# Altium schematic sheet llrf_afe_pwr.SchDoc: =GlobalProjectName
size 209 x 297 mm; SheetNumber: 9; SheetTotal: 17; PageSetup: Record=PageOptions|CenterHorizontal=True|CenterVertical=True|PrintScale=1.00|XCorrection=1.00|YCorrection=1.00|PrintKind=1|BorderSize=5000000|LeftOffset=0|BottomOffset=0|Orientation=2|PaperLength=1000|PaperWidth=1000|Scale=100|PaperSource=15|PrintQuality=1200|MediaType=1|DitherType=10|PaperKind=A3|PrintScaleMode=1; Weight: -; ScaleFactor: -; R_EN1: 100к; R_EN2: NU; R_FB1: 150к; R_FB2: 47к
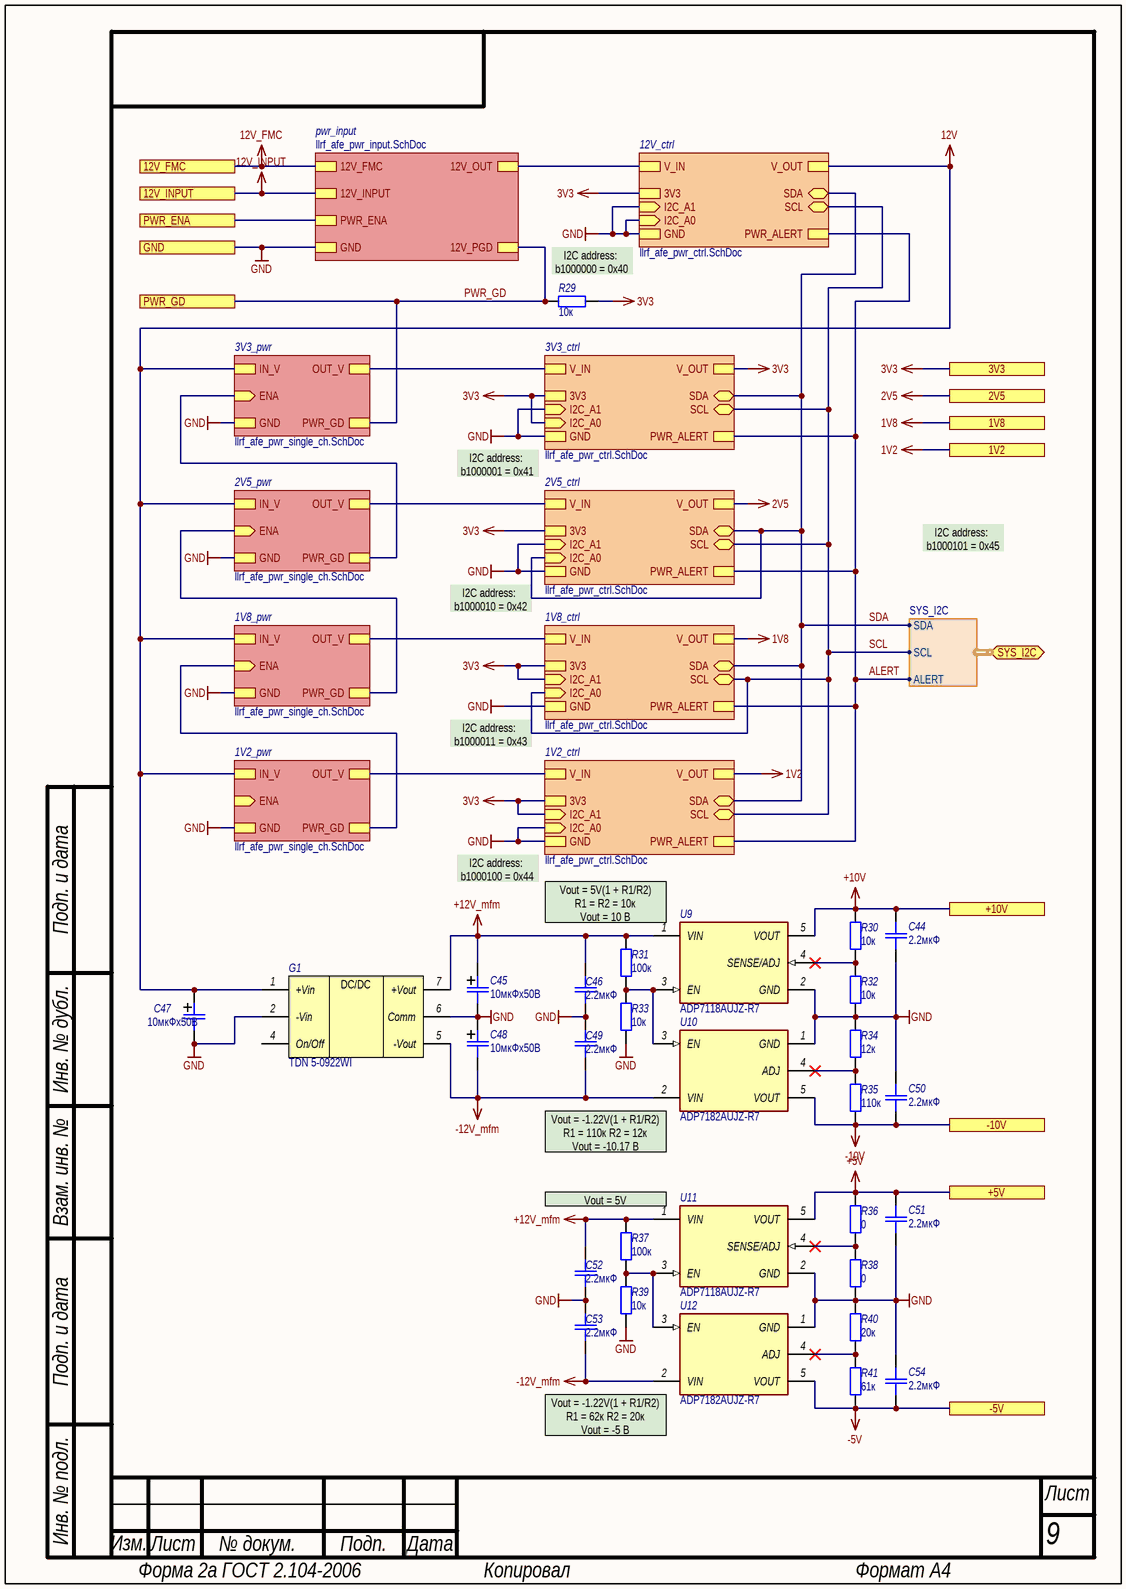
[diagram p0: llrf_afe_pwr.SchDoc]

## Parts
C44  2.2мкФ  [SMD_C0603]
C45  10мкФх50В  [SMD_size_B]
C46  2.2мкФ  [SMD_C0603]
C47  10мкФх50В  [SMD_size_B]
C48  10мкФх50В  [SMD_size_B]
C49  2.2мкФ  [SMD_C0603]
C50  2.2мкФ  [SMD_C0603]
C51  2.2мкФ  [SMD_C0603]
C52  2.2мкФ  [SMD_C0603]
C53  2.2мкФ  [SMD_C0603]
C54  2.2мкФ  [SMD_C0603]
G1  TDN 5-0922WI  [TDN_5_WISM]
R29  10к  [SMD_0603]
R30  10к  [SMD_0603]
R31  100к  [SMD_0603]
R32  10к  [SMD_0603]
R33  10к  [SMD_0603]
R34  12к  [SMD_0603]
R35  110к  [SMD_0603]
R36  0  [SMD_0603]
R37  100к  [SMD_0603]
R38  0  [SMD_0603]
R39  10к  [SMD_0603]
R40  20к  [SMD_0603]
R41  61к  [SMD_0603]
U9  Наименование: ADP7118AUJZ-R7  [TSOT-5]  (hidden comment: ADP7118AUJZ)
U10  Наименование: ADP7182AUJZ-R7  [TSOT-5]  (hidden comment: ADP7182AUJZ)
U11  Наименование: ADP7118AUJZ-R7  [TSOT-5]  (hidden comment: ADP7118AUJZ)
U12  Наименование: ADP7182AUJZ-R7  [TSOT-5]  (hidden comment: ADP7182AUJZ)

## Sub-sheets
1V2_ctrl = llrf_afe_pwr_ctrl.SchDoc: SDA (bidir), V_OUT, SCL (bidir), V_IN, PWR_ALERT, I2C_A1 (in), I2C_A0 (in), 3V3, GND  | LED_COLOR: green; TestPoint_Name: 1V2
1V2_pwr = llrf_afe_pwr_single_ch.SchDoc: OUT_V, IN_V, ENA (in), PWR_GD, GND  | R_EN1: 100к; R_EN2: NU; R_FB1: 7к5; R_FB2: 15к; LED_COLOR: red; TestPoint_Name: 1V2
1V8_ctrl = llrf_afe_pwr_ctrl.SchDoc: SDA (bidir), V_OUT, SCL (bidir), V_IN, PWR_ALERT, I2C_A1 (in), I2C_A0 (in), 3V3, GND  | LED_COLOR: green; TestPoint_Name: 1V8
1V8_pwr = llrf_afe_pwr_single_ch.SchDoc: OUT_V, IN_V, ENA (in), PWR_GD, GND  | R_EN1: 100к; R_EN2: NU; R_FB1: 15к; R_FB2: 12к; LED_COLOR: red; TestPoint_Name: 1V8
2V5_ctrl = llrf_afe_pwr_ctrl.SchDoc: SDA (bidir), V_OUT, SCL (bidir), V_IN, PWR_ALERT, I2C_A1 (in), I2C_A0 (in), 3V3, GND  | LED_COLOR: green; TestPoint_Name: 2V5
2V5_pwr = llrf_afe_pwr_single_ch.SchDoc: OUT_V, IN_V, ENA (in), PWR_GD, GND  | R_EN1: 100к; R_EN2: NU; R_FB1: 12к; R_FB2: 5к6; LED_COLOR: red; TestPoint_Name: 2V5
3V3_ctrl = llrf_afe_pwr_ctrl.SchDoc: SDA (bidir), V_OUT, SCL (bidir), V_IN, PWR_ALERT, I2C_A1 (in), I2C_A0 (in), 3V3, GND  | LED_COLOR: green; TestPoint_Name: 3V3
3V3_pwr = llrf_afe_pwr_single_ch.SchDoc: OUT_V, PWR_GD, IN_V, ENA (in), GND  | R_EN1: 100к; R_EN2: NU; R_FB1: 16к; R_FB2: 5к1; LED_COLOR: red; TestPoint_Name: 3V3
12V_ctrl = llrf_afe_pwr_ctrl.SchDoc: SDA (bidir), V_OUT, SCL (bidir), V_IN, PWR_ALERT, I2C_A1 (in), I2C_A0 (in), 3V3, GND  | LED_COLOR: green; TestPoint_Name: 12V
pwr_input = llrf_afe_pwr_input.SchDoc: 12V_FMC, 12V_INPUT, 12V_OUT, 12V_PGD, GND, PWR_ENA  | TestPoint_Name: 12V

## Ports
1V2, 1V8, 2V5, 3V3, 12V_FMC, 12V_INPUT, +5V, +10V, -5V, -10V, GND, PWR_ENA, PWR_GD, SYS_I2C (bidir, harness SYS_I2C)

## Harnesses
SYS_I2C: SDA, SCL, ALERT

## Nets
1V2: port 1V2, sheet 1V2_ctrl/V_OUT
1V8: port 1V8, sheet 1V8_ctrl/V_OUT
2V5: port 2V5, sheet 2V5_ctrl/V_OUT
3V3: R29.1 ; port 3V3, sheet 3V3_ctrl/V_OUT, sheet 3V3_ctrl/I2C_A0, sheet 3V3_ctrl/3V3, sheet 2V5_ctrl/3V3, sheet 1V8_ctrl/I2C_A1, sheet 1V8_ctrl/3V3, sheet 12V_ctrl/3V3, sheet 1V2_ctrl/I2C_A1, sheet 1V2_ctrl/3V3
12V: C47.1 G1.1(+Vin) ; sheet 3V3_pwr/IN_V, sheet 2V5_pwr/IN_V, sheet 1V8_pwr/IN_V, sheet 12V_ctrl/V_OUT, sheet 1V2_pwr/IN_V
12V_FMC: port 12V_FMC, sheet pwr_input/12V_FMC
12V_INPUT: port 12V_INPUT, sheet pwr_input/12V_INPUT
+5V: C51.2 R36.2 U11.5(VOUT) ; port +5V
+10V: C44.2 R30.2 U9.5(VOUT) ; port +10V
+12V_mfm: C45.1 C46.2 C52.2 G1.7(+Vout) R31.2 R37.2 U9.1(VIN) U11.1(VIN)
-5V: C54.1 R41.1 U12.5(VOUT) ; port -5V
-10V: C50.1 R35.1 U10.5(VOUT) ; port -10V
-12V_mfm: C48.2 C49.1 C53.1 G1.5(-Vout) U10.2(VIN) U12.2(VIN)
GND: C44.1 C45.2 C46.1 C47.2 C48.1 C49.2 C50.2 C51.1 C52.1 C53.2 C54.2 G1.2(-Vin) G1.6(Comm) R32.1 R33.1 R34.2 R38.1 R39.1 R40.2 U9.2(GND) U10.1(GND) U11.2(GND) U12.1(GND) ; port GND, sheet 3V3_pwr/GND, sheet 2V5_pwr/GND, sheet 1V8_pwr/GND, sheet 3V3_ctrl/I2C_A1, sheet 3V3_ctrl/GND, sheet 2V5_ctrl/I2C_A1, sheet 2V5_ctrl/GND, sheet 1V8_ctrl/GND, sheet 12V_ctrl/I2C_A1, sheet 12V_ctrl/I2C_A0, sheet 12V_ctrl/GND, sheet 1V2_pwr/GND, sheet 1V2_ctrl/I2C_A0, sheet 1V2_ctrl/GND, sheet pwr_input/GND
ALERT: sheet 3V3_ctrl/PWR_ALERT, sheet 2V5_ctrl/PWR_ALERT, sheet 1V8_ctrl/PWR_ALERT, sheet 12V_ctrl/PWR_ALERT, sheet 1V2_ctrl/PWR_ALERT, port SYS_I2C.ALERT
PWR_ENA: port PWR_ENA, sheet pwr_input/PWR_ENA
PWR_GD: R29.2 ; port PWR_GD, sheet 3V3_pwr/PWR_GD, sheet pwr_input/12V_PGD
SCL: sheet 3V3_ctrl/SCL, sheet 2V5_ctrl/SCL, sheet 1V8_ctrl/SCL, sheet 1V8_ctrl/I2C_A0, sheet 12V_ctrl/SCL, sheet 1V2_ctrl/SCL, port SYS_I2C.SCL
SDA: sheet 3V3_ctrl/SDA, sheet 2V5_ctrl/SDA, sheet 2V5_ctrl/I2C_A0, sheet 1V8_ctrl/SDA, sheet 12V_ctrl/SDA, sheet 1V2_ctrl/SDA, port SYS_I2C.SDA
NetR30_1: R30.1 R32.2 U9.4(SENSE/ADJ)
NetR31_1: R31.1 R33.2 U9.3(EN) U10.3(EN)
NetR34_1: R34.1 R35.2 U10.4(ADJ)
NetR36_1: R36.1 R38.2 U11.4(SENSE/ADJ)
NetR37_1: R37.1 R39.2 U11.3(EN) U12.3(EN)
NetR40_1: R40.1 R41.2 U12.4(ADJ)
(unnamed): sheet 3V3_pwr/OUT_V, sheet 3V3_ctrl/V_IN
(unnamed): sheet 3V3_pwr/ENA, sheet 2V5_pwr/PWR_GD
(unnamed): sheet 2V5_pwr/OUT_V, sheet 2V5_ctrl/V_IN
(unnamed): sheet 2V5_pwr/ENA, sheet 1V8_pwr/PWR_GD
(unnamed): sheet 1V8_pwr/OUT_V, sheet 1V8_ctrl/V_IN
(unnamed): sheet 1V8_pwr/ENA, sheet 1V2_pwr/PWR_GD
(unnamed): sheet 12V_ctrl/V_IN, sheet pwr_input/12V_OUT
(unnamed): sheet 1V2_pwr/OUT_V, sheet 1V2_ctrl/V_IN

Not connected (* = marked no-connect by the designer): G1 4(On/Off)

## Notes on the sheet
- (near R29) I2C address:
  b1000000 = 0x40
- I2C address:
  b1000001 = 0x41
- I2C address:
  b1000101 = 0x45
- I2C address:
  b1000010 = 0x42
- I2C address:
  b1000011 = 0x43
- I2C address:
  b1000100 = 0x44
- Vout = 5V(1 + R1/R2)
  R1 = R2 = 10к
  Vout = 10 В
- (near U10) Vout = -1.22V(1 + R1/R2)
  R1 = 110к R2 = 12к
  Vout = -10.17 В
- Vout = 5V
- (near U12) Vout = -1.22V(1 + R1/R2)
  R1 = 62к R2 = 20к
  Vout = -5 В
- Подп. и дата
- Инв. № дубл.
- Взам. инв. №
- Инв. № подл.
- Изм.
- Лист
- № докум.
- Подп.
- Дата
- Форма 2а ГОСТ 2.104-2006
- Копировал
- Формат А4
- (in symbol TDN_5) DC/DC

## Library data of the parts
C44 C46 C49-C54 = Capacitor: Назначение: SMD-конденсатор; Наименование: Конденсатор; Потребление, Вт: 0; Value: 2.2мкФ
C45 C47 C48 = Capacitor_pol: Polarized capacitor; Назначение: Поляризованный SMD-конденсатор; Наименование: Поляризованный конденсатор; Потребление, Вт: 0; Value: 10мкФх50В
G1 = TDN_5: DC/DC converter; Назначение: DC-DC преобразователь; Потребление, Вт: 0,01; Наименование: TDN 5-0922WI; ComponentLink1Description: DataSheet; ComponentLink1URL: https://www.tracopower.com/sites/default/files/products/datasheets/tdn5wi_datasheet.pdf
R29-R41 = Resistor: Наименование: Резистор; Назначение: SMD-резистор; Потребление, Вт: 0,001
  R29 R30 R32 R33 R39: Value: 10к
  R31 R37: Value: 100к
  R34: Value: 12к
  R35: Value: 110к
  R36 R38: Value: 0
  R40: Value: 20к
  R41: Value: 61к
U9 U11 = ADP7118AUJZ: 20 V, 200 mA, Low Noise, CMOS LDO Linear Regulator; Потребление, Вт: 0.1; Назначение: 20 V, 200 mA, Low Noise, CMOS LDO Linear Regulator; ComponentLink1Description: DataSheet; ComponentLink1URL: https://www.analog.com/media/en/technical-documentation/data-sheets/adp7118.pdf
U10 U12 = ADP7182AUJZ: –28 V, −200 mA, Low Noise, Linear Regulator; Потребление, Вт: 0.1; Назначение: –28 V, −200 mA, Low Noise, Linear Regulator; ComponentLink1Description: DataSheet; ComponentLink1URL: https://www.analog.com/media/en/technical-documentation/data-sheets/ADP7182.pdf